# Altium schematic sheet 14_BTB_Connector_P1-P100.SchDoc: Board to Board Connector A
size 420 x 297 mm; Author: Lukas Henkel; DocumentNumber: 14; SheetNumber: 14; SheetTotal: 16; DocSize: A3
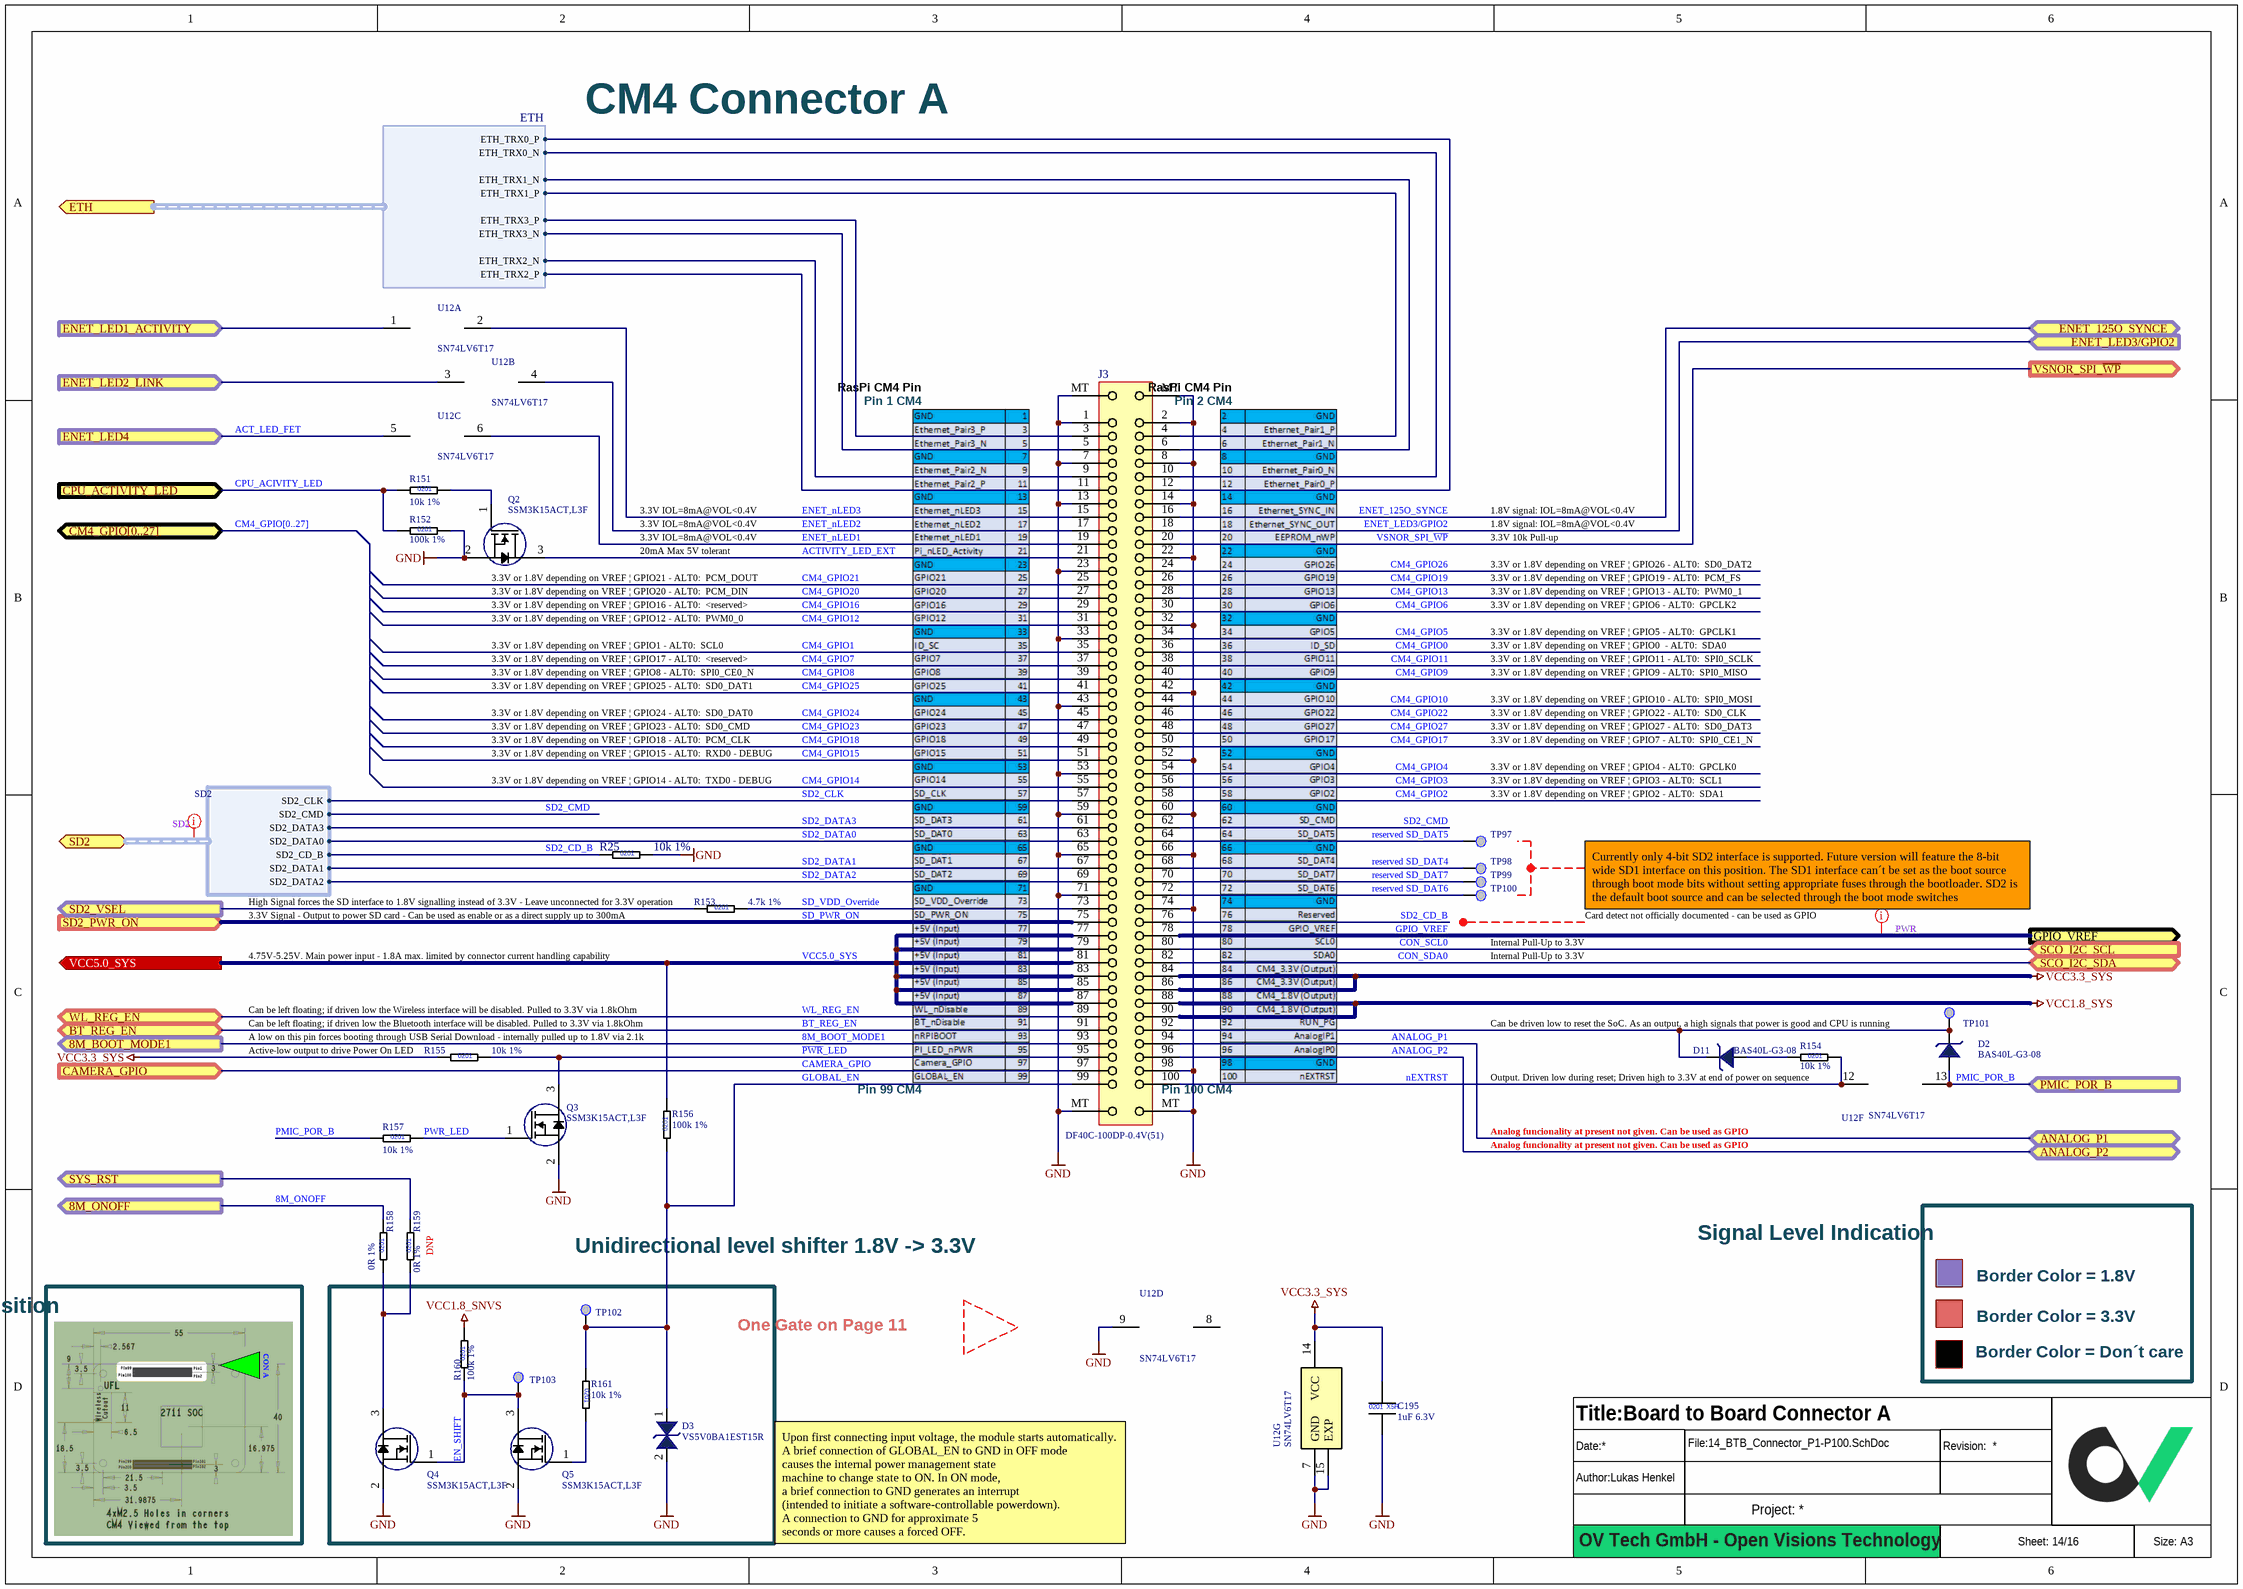
[diagram p0: 14_BTB_Connector_P1-P100.SchDoc]

## Parts
?  (no value)  (graphical)
C195  1uF 6.3V  [CAPC0603X03L]
D2  BAS40L-G3-08  [DFN1006-2A]
D3  VS5V0BA1EST15R  [DFN38P60X29-2L]
D11  BAS40L-G3-08  [DFN1006-2A]
J3  DF40C-100DP-0.4V(51)  [BOARD-TO-BOARD DF40C-100DP-0.4V]
Q2  SSM3K15ACT,L3F  [DFN65P100X50-3L]
Q3  SSM3K15ACT,L3F  [DFN65P100X50-3L]
Q4  SSM3K15ACT,L3F  [DFN65P100X50-3L]
Q5  SSM3K15ACT,L3F  [DFN65P100X50-3L]
R25  10k 1%  [RESC0603X03L]
R151  10k 1%  [RESC0603X03L]
R152  100k 1%  [RESC0603X03L]
R153  4.7k 1%  [RESC0603X03L]
R154  10k 1%  [RESC0603X03L]
R155  10k 1%  [RESC0603X03L]
R156  100k 1%  [RESC0603X03L]
R157  10k 1%  [RESC0603X03L]
R158  0R 1%  [RESC0603X03L]
R159  0R 1%  [RESC0603X03L]
R160  100k 1%  [RESC0603X03L]
R161  10k 1%  [RESC0603X03L]
TP97  Testpoint 0.5mm  [TP_0.50mm]  (value not drawn)  (no BOM)
TP98  Testpoint 0.5mm  [TP_0.50mm]  (value not drawn)  (no BOM)
TP99  Testpoint 0.5mm  [TP_0.50mm]  (value not drawn)  (no BOM)
TP100  Testpoint 0.5mm  [TP_0.50mm]  (value not drawn)  (no BOM)
TP101  Testpoint 0.5mm  [TP_0.50mm]  (value not drawn)  (no BOM)
TP102  Testpoint 0.5mm  [TP_0.50mm]  (value not drawn)  (no BOM)
TP103  Testpoint 0.5mm  [TP_0.50mm]  (value not drawn)  (no BOM)
U12  SN74LV6T17  [QFN50P250X300X80_HS-13L]  (parts A,B,C,D,F,G of 7)

## Ports
8M_BOOT_MODE1 (out), 8M_ONOFF (out), ANALOG_P1 (bidir), ANALOG_P2 (bidir), BT_REG_EN (bidir), CAMERA_GPIO (in), CM4_GPIO[0..27] (bidir), CPU_ACTIVITY_LED (in), ENET_125O_SYNCE (bidir), ENET_LED1_ACTIVITY (in), ENET_LED2_LINK (in), ENET_LED3/GPIO2 (in), ENET_LED4 (in), ETH (out, harness ETH), GPIO_VREF (out), PMIC_POR_B (in), SCO_I2C_SCL (in), SCO_I2C_SDA (bidir), SD2 (bidir, harness SD2), SD2_PWR_ON (in), SD2_VSEL (out), SYS_RST (out), VCC5.0_SYS (out), VSNOR_SPI_~{WP} (out), WL_REG_EN (bidir)

## Harnesses
ETH: ETH_TRX0_P, ETH_TRX0_N, ETH_TRX1_N, ETH_TRX1_P, ETH_TRX2_P, ETH_TRX2_N, ETH_TRX3_P, ETH_TRX3_N
SD2: SD2_CLK, SD2_CMD, SD2_CD_B, SD2_DATA0, SD2_DATA1, SD2_DATA2, SD2_DATA3

## Nets
GND: C195.2 D3.2 J3.1 J3.2 J3.7 J3.8 J3.13 J3.14 J3.22 J3.23 J3.32 J3.33 J3.42 J3.43 J3.52 J3.53 J3.59 J3.60 J3.65 J3.66 J3.71 J3.74 J3.98 J3.MT Q2.2(S) Q3.2(S) Q4.2(S) Q5.2(S) R25.2 R152.2 U12.7(GND) U12.9(4A) U12.15(EXP)
VCC1.8_SNVS: R160.2
VCC1.8_SYS: J3.88 J3.90
VCC3.3_SYS: C195.1 J3.84 J3.86 R155.1 U12.14(VCC)
8M_BOOT_MODE1: J3.93 ; port 8M_BOOT_MODE1
8M_ONOFF: R158.2 ; port 8M_ONOFF
ACT_LED_FET: U12.5(3A) ; port ENET_LED4
ACTIVITY_LED_EXT: J3.21 Q2.3(D)
ANALOG_P1: J3.94 ; port ANALOG_P1
ANALOG_P2: J3.96 ; port ANALOG_P2
BT_REG_EN: J3.91 ; port BT_REG_EN
CAMERA_GPIO: J3.97 ; port CAMERA_GPIO
CM4_GPIO0: J3.36
CM4_GPIO1: J3.35
CM4_GPIO2: J3.58
CM4_GPIO3: J3.56
CM4_GPIO4: J3.54
CM4_GPIO5: J3.34
CM4_GPIO6: J3.30
CM4_GPIO7: J3.37
CM4_GPIO8: J3.39
CM4_GPIO9: J3.40
CM4_GPIO10: J3.44
CM4_GPIO11: J3.38
CM4_GPIO12: J3.31
CM4_GPIO13: J3.28
CM4_GPIO14: J3.55
CM4_GPIO15: J3.51
CM4_GPIO16: J3.29
CM4_GPIO17: J3.50
CM4_GPIO18: J3.49
CM4_GPIO19: J3.26
CM4_GPIO20: J3.27
CM4_GPIO21: J3.25
CM4_GPIO22: J3.46
CM4_GPIO23: J3.47
CM4_GPIO24: J3.45
CM4_GPIO25: J3.41
CM4_GPIO26: J3.24
CM4_GPIO27: J3.48
CON_SCL0: J3.80 ; port SCO_I2C_SCL
CON_SDA0: J3.82 ; port SCO_I2C_SDA
CPU_ACIVITY_LED: R151.1 R152.1 ; port CPU_ACTIVITY_LED
EN_SHIFT: Q4.1(G) Q5.3(D) R160.1 TP103.TP
ENET_125O_SYNCE: J3.16 ; port ENET_125O_SYNCE
ENET_LED1_ACTIVITY: U12.1(1A) ; port ENET_LED1_ACTIVITY
ENET_LED2_LINK: U12.3(2A) ; port ENET_LED2_LINK
ENET_LED3/GPIO2: J3.18 ; port ENET_LED3/GPIO2
ENET_nLED1: J3.19 U12.6(3Y)
ENET_nLED2: J3.17 U12.4(2Y)
ENET_nLED3: J3.15 U12.2(1Y)
GLOBAL_EN: D3.1 J3.99 R156.1 R161.1 TP102.TP
GPIO_VREF: J3.78 ; port GPIO_VREF
nEXTRST: J3.100 R154.2 U12.12(6Y)
~{PWR}_LED: J3.95 Q3.3(D) R155.2
PMIC_POR_B: D2.2 R157.1 U12.13(6A) ; port PMIC_POR_B
PWR_LED: Q3.1(G) R157.2
reserved SD_DAT4: J3.68 TP98.TP
reserved SD_DAT5: J3.64 TP97.TP
reserved SD_DAT6: J3.72 TP100.TP
reserved SD_DAT7: J3.70 TP99.TP
SD2_CD_B: J3.76 R25.1 ; port SD2.SD2_CD_B
SD2_CLK: J3.57 ; port SD2.SD2_CLK
SD2_CMD: J3.62 ; port SD2.SD2_CMD
SD2_DATA0: J3.63 ; port SD2.SD2_DATA0
SD2_DATA1: J3.67 ; port SD2.SD2_DATA1
SD2_DATA2: J3.69 ; port SD2.SD2_DATA2
SD2_DATA3: J3.61 ; port SD2.SD2_DATA3
SD2_VSEL: R153.1 ; port SD2_VSEL
SD_PWR_ON: J3.75 ; port SD2_PWR_ON
SD_VDD_Override: J3.73 R153.2
SYS_RST: R159.2 ; port SYS_RST
VCC5.0_SYS: J3.77 J3.79 J3.81 J3.83 J3.85 J3.87 R156.2 ; port VCC5.0_SYS
VSNOR_SPI_~{WP}: J3.20 ; port VSNOR_SPI_~{WP}
WL_REG_EN: J3.89 ; port WL_REG_EN
NetD2_1: D2.1 D11.1 J3.92 TP101.TP
NetD11_2: D11.2 R154.1
NetJ3_3: J3.3 ; port ETH.ETH_TRX3_P
NetJ3_4: J3.4 ; port ETH.ETH_TRX1_P
NetJ3_5: J3.5 ; port ETH.ETH_TRX3_N
NetJ3_6: J3.6 ; port ETH.ETH_TRX1_N
NetJ3_9: J3.9 ; port ETH.ETH_TRX2_N
NetJ3_10: J3.10 ; port ETH.ETH_TRX0_N
NetJ3_11: J3.11 ; port ETH.ETH_TRX2_P
NetJ3_12: J3.12 ; port ETH.ETH_TRX0_P
NetQ2_1: Q2.1(G) R151.2
NetQ4_3: Q4.3(D) R158.1 R159.1
NetQ5_1: Q5.1(G) R161.2

Not connected (* = marked no-connect by the designer): U12 8(4Y)

## Buses and harness runs
bus CM4_GPIO[0..27] = port CM4_GPIO[0..27]

## Layout directives
net class SD2: (no net found under the mark)
net class PWR: GPIO_VREF

## Notes on the sheet
- CM4 Connector A
- RasPi CM4 Pin
- Pin 1 CM4
- Pin 2 CM4
- 3.3V IOL=8mA@VOL<0.4V
- 1.8V signal: IOL=8mA@VOL<0.4V
- (near Q2) 3.3V or 1.8V depending on VREF | GPIO20 - ALT0:  PCM_DIN
- (near Q2) 3.3V or 1.8V depending on VREF | GPIO21 - ALT0:  PCM_DOUT
- 20mA Max 5V tolerant
- 3.3V 10k Pull-up
- 3.3V or 1.8V depending on VREF | GPIO13 - ALT0:  PWM0_1
- 3.3V or 1.8V depending on VREF | GPIO19 - ALT0:  PCM_FS
- 3.3V or 1.8V depending on VREF | GPIO26 - ALT0:  SD0_DAT2
- 3.3V or 1.8V depending on VREF | GPIO1 - ALT0:  SCL0
- 3.3V or 1.8V depending on VREF | GPIO12 - ALT0:  PWM0_0
- (near Q2) 3.3V or 1.8V depending on VREF | GPIO16 - ALT0:  <reserved>
- 3.3V or 1.8V depending on VREF | GPIO17 - ALT0:  <reserved>
- 3.3V or 1.8V depending on VREF | GPIO0  - ALT0:  SDA0
- 3.3V or 1.8V depending on VREF | GPIO5 - ALT0:  GPCLK1
- 3.3V or 1.8V depending on VREF | GPIO6 - ALT0:  GPCLK2
- 3.3V or 1.8V depending on VREF | GPIO11 - ALT0:  SPI0_SCLK
- 3.3V or 1.8V depending on VREF | GPIO8 - ALT0:  SPI0_CE0_N
- 3.3V or 1.8V depending on VREF | GPIO23 - ALT0:  SD0_CMD
- 3.3V or 1.8V depending on VREF | GPIO24 - ALT0:  SD0_DAT0
- 3.3V or 1.8V depending on VREF | GPIO25 - ALT0:  SD0_DAT1
- 3.3V or 1.8V depending on VREF | GPIO9 - ALT0:  SPI0_MISO
- 3.3V or 1.8V depending on VREF | GPIO10 - ALT0:  SPI0_MOSI
- 3.3V or 1.8V depending on VREF | GPIO22 - ALT0:  SD0_CLK
- 3.3V or 1.8V depending on VREF | GPIO27 - ALT0:  SD0_DAT3
- 3.3V or 1.8V depending on VREF | GPIO14 - ALT0:  TXD0 - DEBUG
- 3.3V or 1.8V depending on VREF | GPIO15 - ALT0:  RXD0 - DEBUG
- 3.3V or 1.8V depending on VREF | GPIO18 - ALT0:  PCM_CLK
- (near TP97) 3.3V or 1.8V depending on VREF | GPIO2 - ALT0:  SDA1
- 3.3V or 1.8V depending on VREF | GPIO3 - ALT0:  SCL1
- 3.3V or 1.8V depending on VREF | GPIO4 - ALT0:  GPCLK0
- 3.3V or 1.8V depending on VREF | GPIO7 - ALT0:  SPI0_CE1_N
- (near R153) 3.3V Signal - Output to power SD card - Can be used as enable or as a direct supply up to 300mA
- (near R153) High Signal forces the SD interface to 1.8V signalling instead of 3.3V - Leave unconnected for 3.3V operation
- Card detect not officially documented - can be used as GPIO
- Currently only 4-bit SD2 interface is supported. Future version will feature the 8-bit wide SD1 interface on this position. The SD1 interface can´t be set as the boot source through boot mode bits without setting appropriate fuses through the bootloader. SD2 is the default boot source and can be selected through the boot mode switches
- (near R153) 4.75V-5.25V. Main power input - 1.8A max. limited by connector current handling capability
- Internal Pull-Up to 3.3V
- (near R155) Can be left floating; if driven low the Wireless interface will be disabled. Pulled to 3.3V via 1.8kOhm
- (near R155) Can be left floating; if driven low the Bluetooth interface will be disabled. Pulled to 3.3V via 1.8kOhm
- (near R155) A low on this pin forces booting through USB Serial Download - internally pulled up to 1.8V via 2.1k
- (near R155) Active-low output to drive Power On LED
- (near TP101) Can be driven low to reset the SoC. As an output, a high signals that power is good and CPU is running
- Pin 99 CM4
- Pin 100 CM4
- (near U12) Output. Driven low during reset; Driven high to 3.3V at end of power on sequence
- Analog funcionality at present not given. Can be used as GPIO
- (near R159) DNP
- Unidirectional level shifter 1.8V -> 3.3V
- Signal Level Indication
- CM4 Connector Position
- One Gate on Page 11
- Border Color = 1.8V
- Border Color = 3.3V
- CON A
- Border Color = Don´t care
- Upon first connecting input voltage, the module starts automatically.
  A brief connection of GLOBAL_EN to GND in OFF mode
  causes the internal power management state
  machine to change state to ON. In ON mode,
  a brief connection to GND generates an interrupt
  (intended to initiate a software-controllable powerdown).
  A connection to GND for approximate 5
  seconds or more causes a forced OFF.
- OV Tech GmbH - Open Visions Technology
- (in symbol CAP_0201_1uF_6.3V) 0201; X5R
- (in symbol RES_0201_0R_1%) 0201
- (in symbol RES_0201_4.7k_1%) 0201
- (in symbol RES_0201_10k_1%) 0201
- (in symbol RES_0201_100k_1%) 0201

## Library data of the parts
? = Titleblock_01_OpenSource
C195 = CAP_0201_1uF_6.3V: Multilayer Ceramic Capacitors MLCC - SMD/SMT 0201 6.3VDC; Manufacturer 1: Murata Electronics; Manufacturer 1 Prt. Nr.: GRM033R60J105MEA2D; Manufacturer 2 Prt. Nr.: CL03A105MQ3CSNC; Manufacturer 2: Samsung Electro-Mechanics
D2 D11 = Schottky 40V_200mA_BAS40L-G3-08: Schottky Diodes & Rectifiers; Manufacturer 1: Vishay; Manufacturer 1 Prt. Nr.: BAS40L-G3-08
D3 = ESD Protection Diode_5V_VS5V0BA1EST15R: ESD Diode Suppressors Bidirectional 5V working voltage 0201; Manufacturer 1: ROHM Semiconductor; Manufacturer 1 Prt. Nr.: VS5V0BA1EST15R
J3 = Board to Board Connector_DF40C-100DP-0.4V(51): Board to Board connector 100Pol Stacking Header 0.4mm Pitch; Manufacturer 1: Hirose Connector; Manufacturer 1 Prt. Nr.: DF40C-100DP-0.4V(51)
Q2-Q5 = N-Channel MOSFET_SSM3K15ACT,L3F: MOSFET 30V SGL N-CH TRENCHMOS Logic Level; Manufacturer 1: Toshiba; Manufacturer 1 Prt. Nr.: SSM3K15ACT,L3F
R25 R151 R154 R155 R157 R161 = RES_0201_10k_1%: Thick Film Resistors - SMD 10K OHM 1%; Manufacturer 1: Yageo; Manufacturer 1 Prt. Nr.: RC0201FR-0710KL; Manufacturer 2 Prt. Nr.: CRCW020110K0FNED; Manufacturer 2: Vishay / Dale
R152 R156 R160 = RES_0201_100k_1%: Thick Film Resistors - SMD 100K OHM 1%; Manufacturer 1: Yageo; Manufacturer 1 Prt. Nr.: RC0201FR-07100KL; Manufacturer 2 Prt. Nr.: CRCW0201100KFNED; Manufacturer 2: Vishay / Dale
R153 = RES_0201_4.7k_1%: Thick Film Resistors - SMD 4.7K OHM 1%; Manufacturer 1: Yageo; Manufacturer 1 Prt. Nr.: RC0201JR-074K7P; Manufacturer 2 Prt. Nr.: CRCW02014K70FNED; Manufacturer 2: Vishay / Dale
R158 R159 = RES_0201_0R_1%: Thick Film Resistors - SMD 0R OHM 1%; Manufacturer 1: Yageo; Manufacturer 1 Prt. Nr.: RC0201FR-070RL; Manufacturer 2 Prt. Nr.: CRCW02010000Z0ED; Manufacturer 2: Vishay / Dale
U12 = Hex_Schmitt-Buffer_LvL-Shift_SN74LV6T17: Hex Schmitt-Trigger Buffer with Integrated Translation; Manufacturer 1: NXP Semiconductors; Manufacturer 1 Prt. Nr.: SN74LV6T17BQAR